# Altium schematic sheet Current Sense.SchDoc
size A4
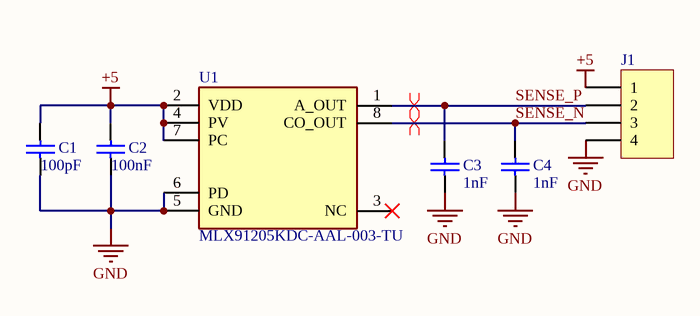
[diagram p0: Current Sense.SchDoc]

## Parts
C1  value 100pF  [0402]  (hidden comment: Cap)
C2  value 100nF  [0402]  (hidden comment: Cap)
C3  value 1nF  [0402]  (hidden comment: Cap)
C4  value 1nF  [0402]  (hidden comment: Cap)
J1  Header 4H  [HDR1X4]  (value not drawn)
U1  MLX91205KDC-AAL-003-TU  [SOIC127P602X173-8N]

## Nets
+5: C1.2 C2.2 J1.1 U1.2(VDD) U1.4(PV) U1.7(PC)
GND: C1.1 C2.1 C3.1 C4.1 J1.4 U1.5(GND) U1.6(PD)
SENSE_N: C4.2 J1.3 U1.8(CO_OUT)
SENSE_P: C3.2 J1.2 U1.1(A_OUT)

Not connected (* = marked no-connect by the designer): U1 3(NC)*

## Layout directives
differential pair: SENSE_N, SENSE_P

## Library data of the parts
C1-C4 = Cap: Capacitor; Published: 8-Jun-2000; LatestRevisionDate: 17-Jul-2002; LatestRevisionNote: Re-released for DXP Platform.; PackageReference: RAD-0.3; Publisher: Altium Limited; PackageDescription: Radial Cap, Thru-Hole; 2 Leads; 0.3 in Pin Spacing
J1 = Header 4H: Header, 4-Pin, Right Angle; LatestRevisionDate: 17-Jul-2002; LatestRevisionNote: Re-released for DXP Platform.; Publisher: Altium Limited
U1 = MLX91205KDC-AAL-003-TU: Integrated Circuit; Manufacturer_Name: Melexis; Datasheet Link: http://www.mouser.com/datasheet/2/734/MLX91205-Datasheet-Melexis-953301.pdf; Height: 1.73mm; Manufacturer_Part_Number: MLX91205KDC-AAL-003-TU; Arrow Part Number: MLX91205KDC-AAL-003-TU; Mouser Part Number: 482-91205KDCAAL003TU; Mouser Price/Stock: https://www.mouser.com/Search/Refine.aspx?Keyword=482-91205KDCAAL003TU